# EAGLE schematic OVC3860_Bluetooth_Receiver (EAGLE 6.4)
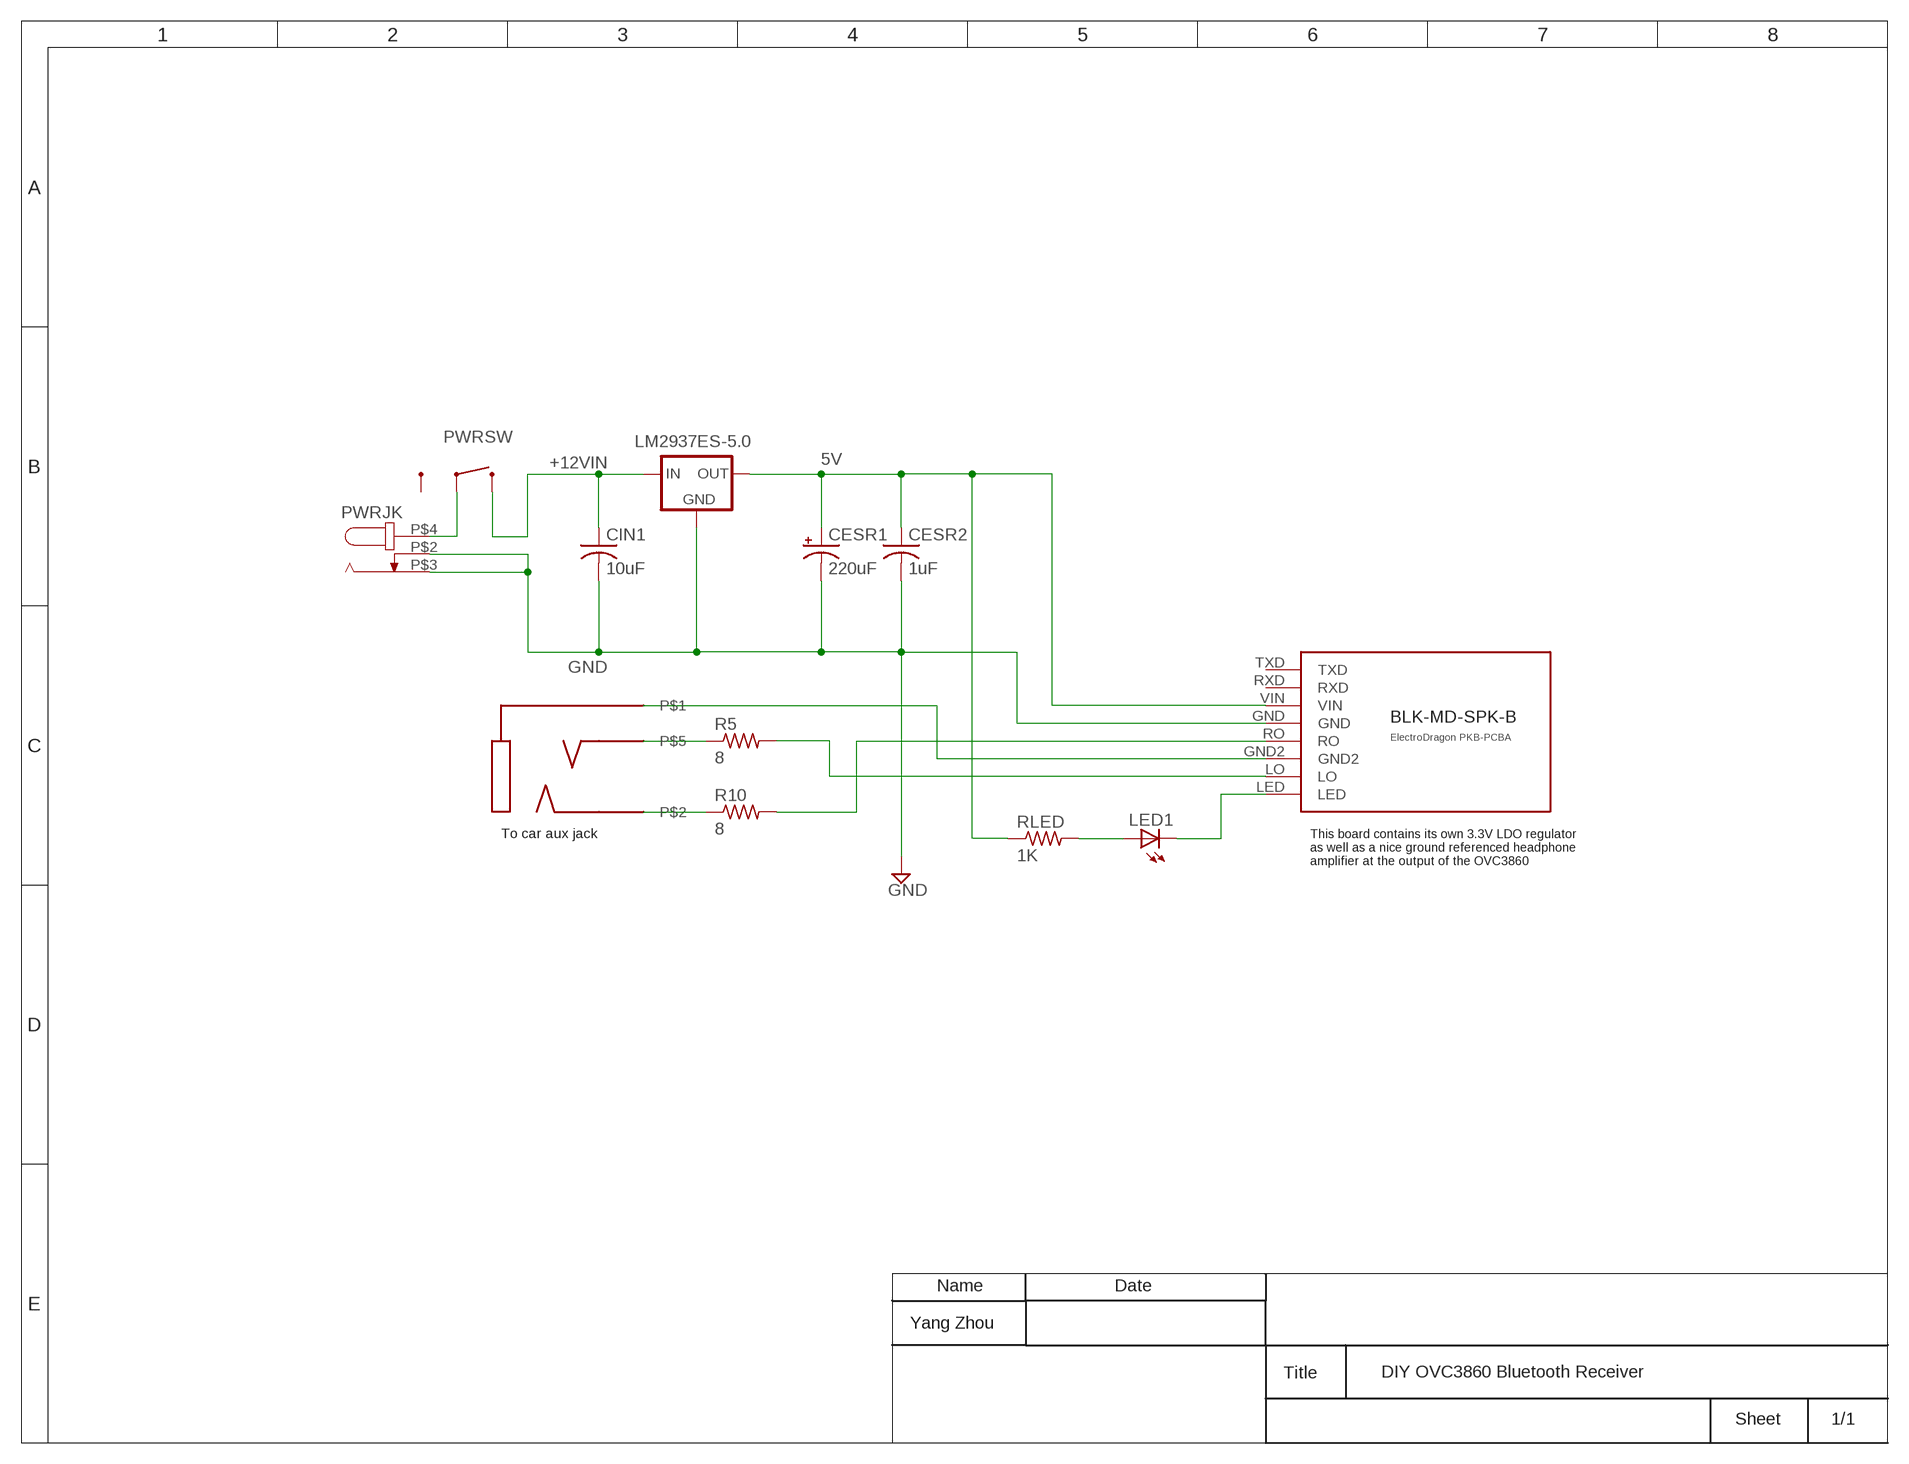
[diagram p0: schematic, sheet 1]

## Parts
CESR1  220uF  CPOL-USE3.5-8  [E3,5-8]
CESR2  1uF  C-USC1206  [C1206]
CIN1  10uF  C-USC1206  [C1206]
LED1  LEDCHIPLED_1206  [CHIPLED_1206]
LM2937ES-5.0  LM340S-5.0  [TO-263-3]
PWRJK  A-4118_DCPOWJACK  [A-4118]
PWRSW  103-12100-EV  [103-12100-EV]
R5  8  R-US_0207/7  [0207/7]
R10  8  R-US_0207/7  [0207/7]
RLED  1K  R-US_R0805  [R0805]
U$2  STX-3120-3B  [STX-3120-3B]
U$3  PKB-PCBA  [PKB-PCBA]

## Nets
+12VIN: CIN1.1 LM2937ES-5.0.1(IN) PWRSW.3
GND: CESR1.- CESR2.2 CIN1.2 LM2937ES-5.0.2(GND) LM2937ES-5.0.GND PWRJK.P$2 PWRJK.P$3 U$3.GND
N$1: CESR1.+ CESR2.1 LM2937ES-5.0.3(OUT) RLED.1 U$3.VIN
N$2: U$2.1 U$3.GND2
N$3: R5.1 U$2.5
N$4: R10.1 U$2.2
N$5: LED1.C U$3.LED
N$6: LED1.A RLED.2
N$7: R5.2 U$3.LO
N$8: R10.2 U$3.RO
N$18: PWRJK.P$4 PWRSW.2
Unconnected: PWRSW.1 U$3.RXD U$3.TXD

## Notes on the sheet
- 5V
- To car aux jack
- This board contains its own 3.3V LDO regulator
  as well as a nice ground referenced headphone
  amplifier at the output of the OVC3860
- DIY OVC3860 Bluetooth Receiver

## Library data of the parts
CESR1 = rcl:CPOL-US: POLARIZED CAPACITOR, American symbol
CESR2 CIN1 = rcl:C-US: CAPACITOR, American symbol
LED1 = led:LED: LED OSRAM: - CHIPLED LG R971, LG N971, LY N971, LG Q971, LY Q971, LO R971, LY R971 LH N974, LH R974 LS Q976, LO Q976, LY Q976 LO Q996 - Hyper CHIPLED LW Q18S LB Q993, LB Q99A, LB R99A - SideLED LS A670, LO A670, LY A670, LG A670, LP A670 LB A673, LV A673, LT A673, LW A673 LH A674 LY A675 LS A676, LA A676, LO A676, LY A676, LW A676 LS A679, LY A679, LG A679 - Hyper Micro SIDELED® LS Y876, LA Y876, LO Y876, LY Y876 LT Y87S - SmartLED LW L88C, LW L88S LB L89C, LB L89S, LG L890 LS L89K, LO L89K, LY L89K LS L896, LA L896, LO L896, LY L896 - TOPLED LS T670, LO T670, LY T670, LG T670, LP T670 LSG T670, LSP T670, LSY T670, LOP T670, LYG T670 LG T671, LOG T671, LSG T671 LB T673, LV T673, LT T673, LW T673 LH T674 LS T676, LA T676, LO T676, LY T676, LB T676, LH T676, LSB T676, LW T676 LB T67C, LV T67C, LT T67C, LS T67K, LO T67K, LY T67K, LW E67C LS E67B, LA E67B, LO E67B, LY E67B, LB E67C, LV E67C, LT E67C LW T67C LS T679, LY T679, LG T679 LS T770, LO T770, LY T770, LG T770, LP T770 LB T773, LV T773, LT T773, LW T773 LH T774 LS E675, LA E675, LY E675, LS T675 LS T776, LA T776, LO T776, LY T776, LB T776 LHGB T686 LT T68C, LB T68C - Hyper Mini TOPLED® LB M676 - Mini TOPLED Santana® LG M470 LS M47K, LO M47K, LY M47K Source: http://www.osram.convergy.de LUXEON: - LUMILED® LXK2-PW12-R00, LXK2-PW12-S00, LXK2-PW14-U00, LXK2-PW14-V00 LXK2-PM12-R00, LXK2-PM12-S00, LXK2-PM14-U00 LXK2-PE12-Q00, LXK2-PE12-R00, LXK2-PE12-S00, LXK2-PE14-T00, LXK2-PE14-U00 LXK2-PB12-K00, LXK2-PB12-L00, LXK2-PB12-M00, LXK2-PB14-N00, LXK2-PB14-P00, LXK2-PB14-Q00 LXK2-PR12-L00, LXK2-PR12-M00, LXK2-PR14-Q00, LXK2-PR14-R00 LXK2-PD12-Q00, LXK2-PD12-R00, LXK2-PD12-S00 LXK2-PH12-R00, LXK2-PH12-S00 LXK2-PL12-P00, LXK2-PL12-Q00, LXK2-PL12-R00 Source: www.luxeon.com KINGBRIGHT: KA-3528ASYC Source: www.kingbright.com
LM2937ES-5.0 = VREG-yz:LM340S-5.0
PWRJK = yz-parts:A-4118_DCPOWJACK
PWRSW = yz-parts:103-12100-EV
R5 R10 RLED = rcl:R-US_: RESISTOR, American symbol
U$2 = yz-parts:STX-3120-3B
U$3 = yz-parts:PKB-PCBA